# EAGLE schematic acs758 (EAGLE 9.6.2)
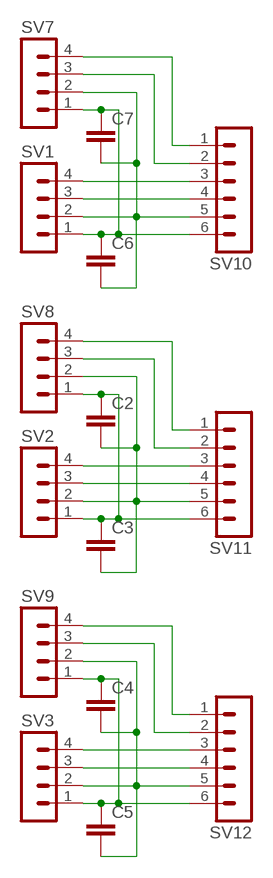
[diagram p0: schematic, sheet 1]

## Parts
C2  C-EU025-025X050  [C025-025X050]
C3  C-EU025-025X050  [C025-025X050]
C4  C-EU025-025X050  [C025-025X050]
C5  C-EU025-025X050  [C025-025X050]
C6  C-EU025-025X050  [C025-025X050]
C7  C-EU025-025X050  [C025-025X050]
SV1  MA04-1  [MA04-1]
SV2  MA04-1  [MA04-1]
SV3  MA04-1  [MA04-1]
SV7  MA04-1  [MA04-1]
SV8  MA04-1  [MA04-1]
SV9  MA04-1  [MA04-1]
SV10  MA06-1  [MA06-1]
SV11  MA06-1  [MA06-1]
SV12  MA06-1  [MA06-1]

## Nets
N$1: SV1.3 SV10.4
N$3: C4.1 C5.1 SV3.1 SV9.1 SV12.6
N$4: SV2.3 SV11.4
N$5: SV3.3 SV12.4
N$6: SV3.4 SV12.3
N$7: SV9.3 SV12.2
N$8: SV9.4 SV12.1
N$9: C2.1 C3.1 SV2.1 SV8.1 SV11.6
N$11: SV2.4 SV11.3
N$12: SV8.3 SV11.2
N$13: SV8.4 SV11.1
N$14: C6.1 C7.1 SV1.1 SV7.1 SV10.6
N$16: SV1.4 SV10.3
N$17: C6.2 C7.2 SV1.2 SV7.2 SV10.5
N$18: C2.2 C3.2 SV2.2 SV8.2 SV11.5
N$19: SV7.3 SV10.2
N$20: SV7.4 SV10.1
N$21: C4.2 C5.2 SV3.2 SV9.2 SV12.5

## Library data of the parts
C2-C7 = rcl:C-EU: CAPACITOR, European symbol; SPICEPREFIX: C
SV1-SV3 SV7-SV9 = con-lstb:MA04-1: PIN HEADER; OC_FARNELL: unknown; OC_NEWARK: unknown
SV10-SV12 = con-lstb:MA06-1: PIN HEADER; OC_FARNELL: unknown; OC_NEWARK: unknown